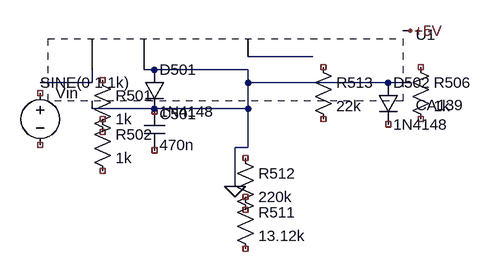
[diagram p0: schematic schematic_clean.asc]
schematic_clean.asc, the LTspice schematic file:
Version 4
SHEET 1 1200 900

* INPUT SECTION
SYMBOL voltage 80 160 R0
WINDOW 3 0 0 Left 0
SYMATTR InstName Vin
SYMATTR Value SINE(0 1 1k)

SYMBOL res 160 140 R0
SYMATTR InstName R501
SYMATTR Value 1k

SYMBOL res 160 200 R0
SYMATTR InstName R502
SYMATTR Value 1k

SYMBOL cap 240 200 R0
SYMATTR InstName C501
SYMATTR Value 470n

SYMBOL diode 240 140 R0
SYMATTR InstName D501
SYMATTR Value 1N4148

* COMPARATOR
SYMBOL opamp2 400 160 R0
SYMATTR InstName U1
SYMATTR Value CA139

* HYSTERESIS
SYMBOL res 500 120 R0
SYMATTR InstName R513
SYMATTR Value 22k

* DIVIDER
SYMBOL res 380 260 R0
SYMATTR InstName R512
SYMATTR Value 220k

SYMBOL res 380 320 R0
SYMATTR InstName R511
SYMATTR Value 13.12k

* OUTPUT
SYMBOL diode 600 160 R0
SYMATTR InstName D502
SYMATTR Value 1N4148

SYMBOL res 650 120 R0
SYMATTR InstName R506
SYMATTR Value 1k

* WIRING
WIRE 80 160 160 160
WIRE 160 160 160 140
WIRE 160 200 240 200
WIRE 240 200 400 200
WIRE 240 140 400 140

WIRE 400 140 400 160
WIRE 400 160 400 260
WIRE 400 260 380 260
WIRE 380 260 380 320

WIRE 500 120 400 120
WIRE 400 160 600 160
WIRE 600 160 650 160

FLAG 380 320 0
FLAG 650 80 +5V

The netlist it stands for:
* schematic_clean.asc
Vin NC_01 NC_02 SINE(0 1 1k)
R501 NC_03 NC_04 1k
R502 NC_05 NC_06 1k
C501 0 NC_07 470n
D501 0 NC_08 1N4148
* U1: CA139 (symbol opamp2 not available, pin order unknown); nets seen at it: +5V, 0, N001, N002
R513 NC_09 NC_10 22k
R512 NC_11 NC_12 220k
R511 NC_13 NC_14 13.12k
D502 0 NC_15 1N4148
R506 NC_16 NC_17 1k
.model D D
.lib standard.dio
.backanno
.end